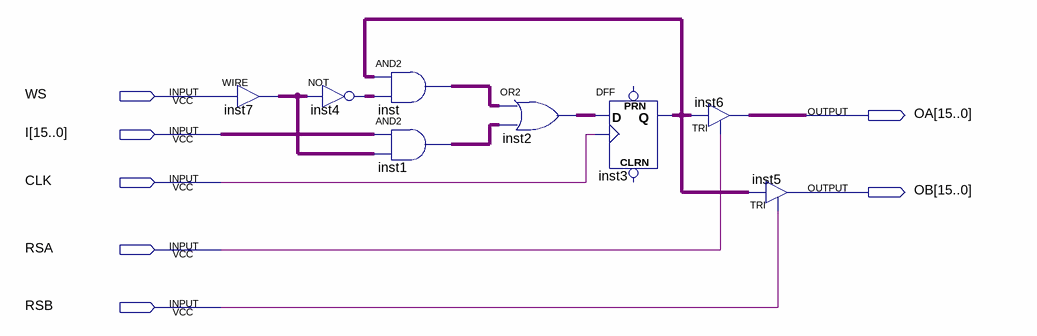
[diagram p0: schematic sheet]
// Quartus schematic REfile16bit.bdf as structural Verilog: 8 symbols, 7 pins
module REfile16bit (
  input  WS,
  input  [15:0] I,
  input  CLK,
  input  RSA,
  input  RSB,
  output [15:0] OA,
  output [15:0] OB
);

  wire [15:0] inst1_out, inst2_out, inst3_q, inst4_out, inst7_out, inst_out;

  assign inst7_out = {16{WS}};  // WIRE inst7
  assign inst4_out = ~inst7_out;  // NOT inst4, 16 bits wide
  assign inst_out = inst3_q & inst4_out;  // AND2 inst, 16 bits wide
  assign inst1_out = I & inst7_out;  // AND2 inst1, 16 bits wide
  assign inst2_out = inst_out | inst1_out;  // OR2 inst2, 16 bits wide
  DFF inst3[15:0] (.CLK(CLK), .D(inst2_out), .Q(inst3_q));  // open: CLRN, PRN
  TRI inst6[15:0] (.IN(inst3_q), .OE(RSA), .OUT(OA));
  TRI inst5[15:0] (.IN(inst3_q), .OE(RSB), .OUT(OB));
endmodule
